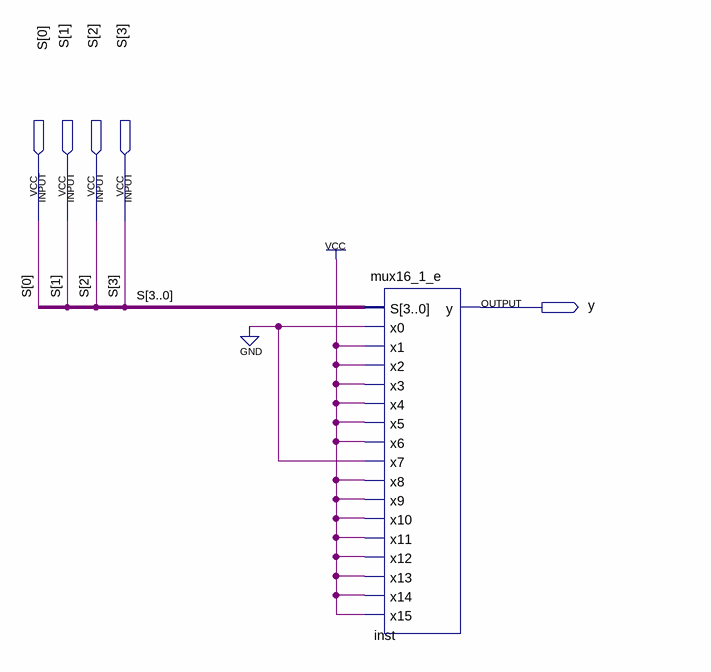
[diagram p0: schematic sheet]
// Quartus schematic fun16_1.bdf as structural Verilog: 1 symbols, 5 pins
module fun16_1 (
  input  [3:0] S,
  output y
);

  mux16_1_e inst (
    .S(S), .x0(1'b0), .x1(1'b1), .x2(1'b1), .x3(1'b1), .x4(1'b1), .x5(1'b1), .x6(1'b1), .x7(1'b0), .x8(1'b1),
    .x9(1'b1), .x10(1'b1), .x11(1'b1), .x12(1'b1), .x13(1'b1), .x14(1'b1), .x15(1'b1), .y(y));
endmodule
